# Altium project 16Z.PrjPcb
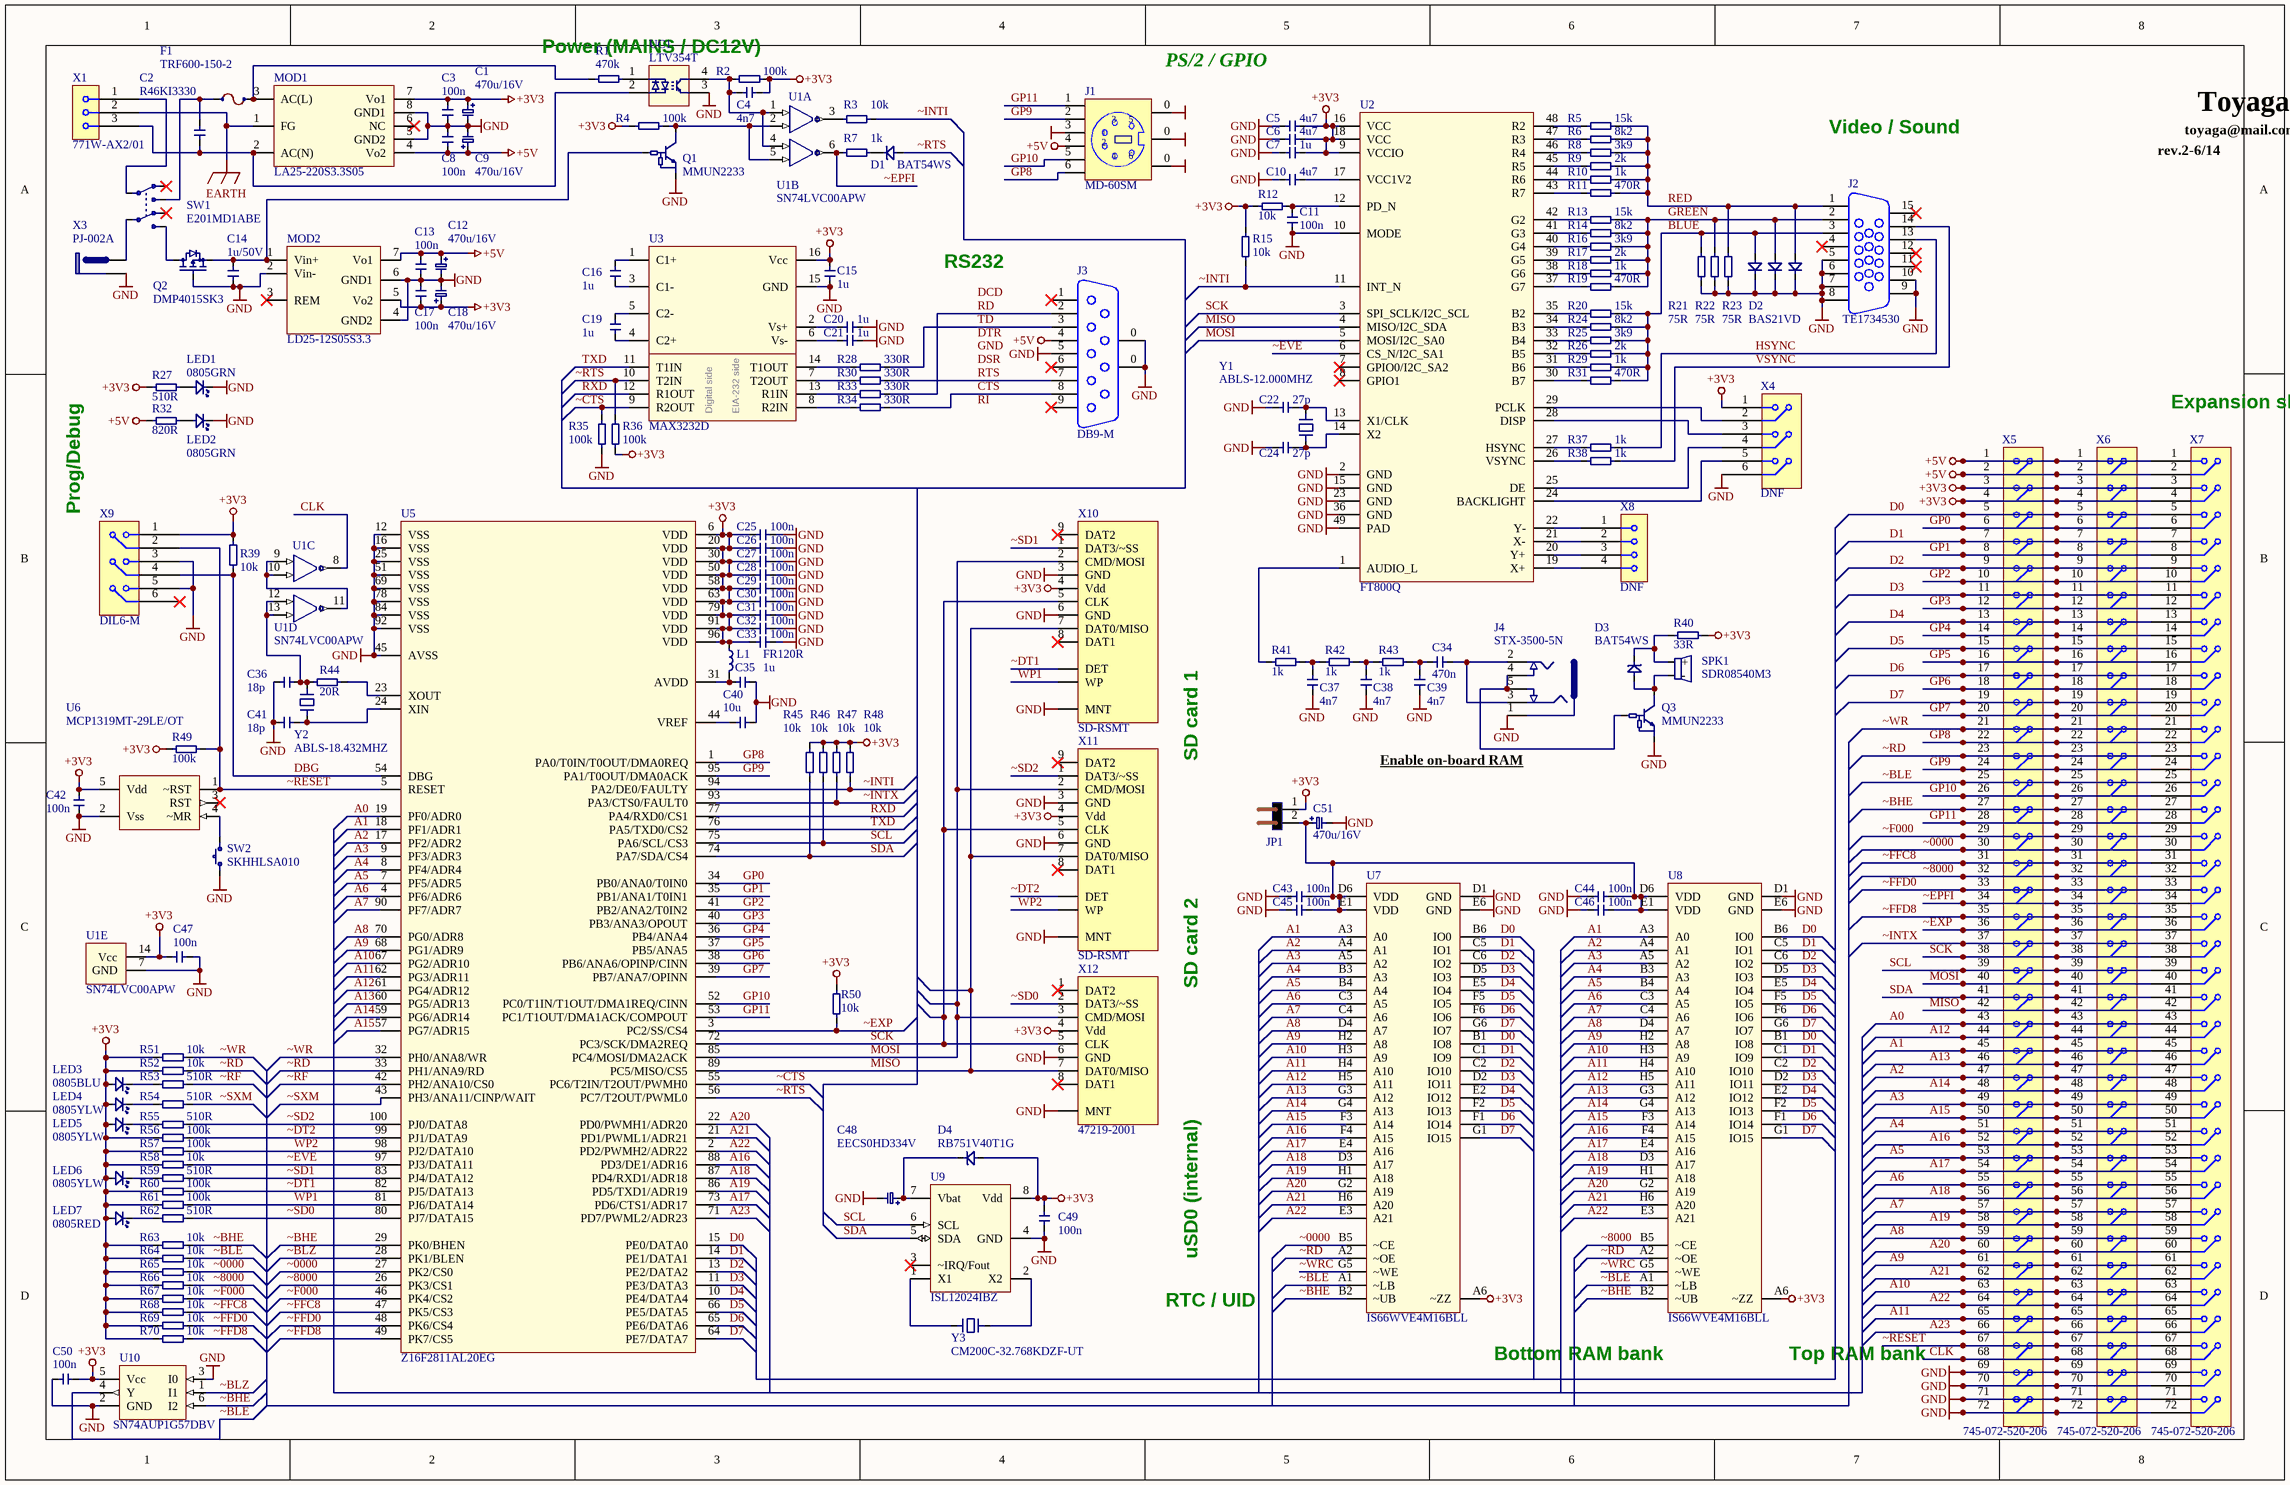
[diagram p0: Schematic.SchDoc]
2 sheets, 181 parts. Net scope: global (net labels, ports and power ports of the same name join across sheets).
Board file: PCB.PcbDoc
Sheets:
  Schematic.SchDoc
  Additions.SchDoc

## Sheet Schematic.SchDoc
size Tabloid

### Parts
C1  470u/16V  [8.5 x 8.5]
C2  R46KI3330  [X2_15MM]
C3  100n  [_0805]
C4  4n7  [_0805]
C5  4u7  [_0805]
C6  4u7  [_0805]
C7  1u  [_0805]
C8  100n  [_0805]
C9  470u/16V  [8.5 x 8.5]
C10  4u7  [_0805]
C11  100n  [_0805]
C12  470u/16V  [8.5 x 8.5]
C13  100n  [_0805]
C14  1u/50V  [_1206]
C15  1u  [_0805]
C16  1u  [_0805]
C17  100n  [_0805]
C18  470u/16V  [8.5 x 8.5]
C19  1u  [_0805]
C20  1u  [_0805]
C21  1u  [_0805]
C22  27p  [_0805]
C24  27p  [_0805]
C25  100n  [_0805]
C26  100n  [_0805]
C27  100n  [_0805]
C28  100n  [_0805]
C29  100n  [_0805]
C30  100n  [_0805]
C31  100n  [_0805]
C32  100n  [_0805]
C33  100n  [_0805]
C34  470n  [_0805]
C35  1u  [_0805]
C36  18p  [_0805]
C37  4n7  [_0805]
C38  4n7  [_0805]
C39  4n7  [_0805]
C40  10u  [_0805]
C41  18p  [_0805]
C42  100n  [_0805]
C43  100n  [_0805]
C44  100n  [_0805]
C45  100n  [_0805]
C46  100n  [_0805]
C47  100n  [_0805]
C48  EECS0HD334V  [D10.5 x L5.5]
C49  100n  [_0805]
C50  100n  [_0805]
C51  470u/16V  [8.5 x 8.5]
D1  BAT54WS  [SOD-323 (MicroMELF)]
D2  BAS21VD  [SOT23-6]
D3  BAT54WS  [SOD-323 (MicroMELF)]
D4  RB751V40T1G  [SOD-323 (MicroMELF)]
F1  TRF600-150-2  [Fuse 5.1mm pitch]
J1  MD-60SM  [MD-60SM]
J2  TE1734530  [DB15F R/A VGA]
J3  DB9-M  [DB9M R/A]
J4  STX-3500-5N  [STX-3500]
JP1  SIL2-M  [2011-1X02S]  (value not drawn)
L1  FR120R  [_0805]
LED1  0805GRN  [_0805+]
LED2  0805GRN  [_0805+]
LED3  0805BLU  [_0805+]
LED4  0805YLW  [_0805+]
LED5  0805YLW  [_0805+]
LED6  0805YLW  [_0805+]
LED7  0805RED  [_0805+]
MOD1  LA25-220S3.3S05  [ECCO AC-DC (70x48)]
MOD2  LD25-12S05S3.3  [DC-DC (50.8x50.8)]
Q1  MMUN2233  [SOT23-3]
Q2  DMP4015SK3  [TO252-3N]
Q3  MMUN2233  [SOT23-3]
R1  470k  [_0805]
R2  100k  [_0805]
R3  10k  [_0805]
R4  100k  [_0805]
R5  15k  [_0805]
R6  8k2  [_0805]
R7  1k  [_0805]
R8  3k9  [_0805]
R9  2k  [_0805]
R10  1k  [_0805]
R11  470R  [_0805]
R12  10k  [_0805]
R13  15k  [_0805]
R14  8k2  [_0805]
R15  10k  [_0805]
R16  3k9  [_0805]
R17  2k  [_0805]
R18  1k  [_0805]
R19  470R  [_0805]
R20  15k  [_0805]
R21  75R  [_0805]
R22  75R  [_0805]
R23  75R  [_0805]
R24  8k2  [_0805]
R25  3k9  [_0805]
R26  2k  [_0805]
R27  510R  [_0805]
R28  330R  [_0805]
R29  1k  [_0805]
R30  330R  [_0805]
R31  470R  [_0805]
R32  820R  [_0805]
R33  330R  [_0805]
R34  330R  [_0805]
R35  100k  [_0805]
R36  100k  [_0805]
R37  1k  [_0805]
R38  1k  [_0805]
R39  10k  [_0805]
R40  33R  [_0805]
R41  1k  [_0805]
R42  1k  [_0805]
R43  1k  [_0805]
R44  20R  [_0805]
R45  10k  [_0805]
R46  10k  [_0805]
R47  10k  [_0805]
R48  10k  [_0805]
R49  100k  [_0805]
R50  10k  [_0805]
R51  10k  [_0805]
R52  10k  [_0805]
R53  510R  [_0805]
R54  510R  [_0805]
R55  510R  [_0805]
R56  100k  [_0805]
R57  100k  [_0805]
R58  10k  [_0805]
R59  510R  [_0805]
R60  100k  [_0805]
R61  100k  [_0805]
R62  510R  [_0805]
R63  10k  [_0805]
R64  10k  [_0805]
R65  10k  [_0805]
R66  10k  [_0805]
R67  10k  [_0805]
R68  10k  [_0805]
R69  10k  [_0805]
R70  10k  [_0805]
SPK1  SDR08540M3  [SDR08540M3-01]
SW1  E201MD1ABE  [E201MD1ABE]
SW2  SKHHLSA010  [SKHH-HORIZONTAL]
U1  SN74LVC00APW  [TSOP65P640-14N]  (value not drawn)  (parts A,B,C,D,E of 5)
U2  FT800Q  [QFN50P700X700-48W2N]
U3  MAX3232D  [SOIC16]
U5  Z16F2811AL20EG  [LQFP100]
U6  MCP1319MT-29LE/OT  [SOT23-5]
U7  IS66WVE4M16BLL  [BGA75P6X8-48]
U8  IS66WVE4M16BLL  [BGA75P6X8-48]
U9  ISL12024IBZ  [SOIC8]
U10  SN74AUP1G57DBV  [SOT23-6]
UC1  LTV354T  [SO4]
X1  771W-AX2/01  [771W-AX2/01]
X3  PJ-002A  [KLD-0202]
X4  DNF  [2011-2X03S]
X5  745-072-520-206  [745-072-520-206]
X6  745-072-520-206  [745-072-520-206]
X7  745-072-520-206  [745-072-520-206]
X8  DNF  [2011-1X04S]
X9  DIL6-M  [2011-2X03S]
X10  SD-RSMT  [SD-RSMT]
X11  SD-RSMT  [SD-RSMT]
X12  47219-2001  [MOLEX_47219-2001]
Y1  ABLS-12.000MHZ  [HC49/SMT]
Y2  ABLS-18.432MHZ  [HC49/SMT]
Y3  CM200C-32.768KDZF-UT  [Crystal 79X37 (4)]

### Nets
+3V3: C1.1 C3.2 C4.2 C5.1 C6.1 C7.1 C15.1 C17.2 C18.1 C25.2 C26.2 C27.2 C28.2 C29.2 C30.2 C31.2 C32.2 C33.2 C42.1 C47.1 C49.1 C50.2 D4.2 JP1.1 L1.2 LED3.2 LED4.2 LED5.2 LED6.2 LED7.2 MOD1.7(Vo1) MOD2.5(Vo2) R2.2 R4.1 R12.1 R15.2 R27.2 R36.1 R39.1 R40.2 R45.2 R46.2 R47.2 R48.2 R49.2 R50.2 R51.2 R52.2 R56.2 R57.2 R58.2 R60.2 R61.2 R63.2 R64.2 R65.2 R66.2 R67.2 R68.2 R69.2 R70.2 U1.14(Vcc) U2.9(VCCIO) U2.16(VCC) U2.18(VCC) U3.16(Vcc) U5.6(VDD) U5.20(VDD) U5.30(VDD) U5.50(VDD) U5.58(VDD) U5.63(VDD) U5.79(VDD) U5.91(VDD) U5.96(VDD) U6.5(Vdd) U7.A6(~ZZ) U8.A6(~ZZ) U9.8(Vdd) U10.5(Vcc) X4.1 X5.3 X5.4 X6.3 X6.4 X7.3 X7.4 X9.1 X10.4(Vdd) X11.4(Vdd) X12.4(Vdd)
+5V: C8.1 C9.1 C12.1 C13.1 J1.4 J3.4 MOD1.4(Vo2) MOD2.7(Vo1) R32.2 X5.1 X5.2 X6.1 X6.2 X7.1 X7.2
EARTH: MOD1.1(FG) X1.2
GND: C1.2 C3.1 C5.2 C6.2 C7.2 C8.2 C9.2 C10.2 C11.2 C12.2 C13.2 C14.2 C15.2 C17.1 C18.2 C20.1 C21.1 C22.2 C24.2 C25.1 C26.1 C27.1 C28.1 C29.1 C30.1 C31.1 C32.1 C33.1 C35.1 C36.2 C37.1 C38.1 C39.1 C40.1 C41.2 C42.2 C43.2 C44.2 C45.2 C46.2 C47.2 C48.2 C49.2 C50.1 C51.2 D2.1 D2.2 D2.3 J1.0 J1.3 J2.5 J2.6 J2.7 J2.8 J2.9 J2.10 J3.0 J3.5 J4.1 LED1.1 LED2.1 MOD1.5(GND2) MOD1.8(GND1) MOD2.2(Vin-) MOD2.4(GND2) MOD2.6(GND1) Q1.2(E) Q2.1(G) Q3.2(E) R21.1 R22.1 R23.1 R35.1 SW2.1 U1.7(GND) U2.2(GND) U2.10(MODE) U2.15(GND) U2.23(GND) U2.36(GND) U2.49(PAD) U3.15(GND) U5.12(VSS) U5.16(VSS) U5.25(VSS) U5.45(AVSS) U5.51(VSS) U5.69(VSS) U5.78(VSS) U5.84(VSS) U5.92(VSS) U6.2(Vss) U7.D1(GND) U7.E6(GND) U8.D1(GND) U8.E6(GND) U9.4(GND) U10.2(GND) U10.3(I0) UC1.3 X3.2 X4.6 X5.69 X5.70 X5.71 X5.72 X6.69 X6.70 X6.71 X6.72 X7.69 X7.70 X7.71 X7.72 X9.3 X9.5 X10.0(MNT) X10.3(GND) X10.6(GND) X11.0(MNT) X11.3(GND) X11.6(GND) X12.0(MNT) X12.6(GND)
A0: U5.19(PF0/ADR0) X5.43 X6.43 X7.43
A1: U5.18(PF1/ADR1) U7.A3(A0) U8.A3(A0) X5.45 X6.45 X7.45
A2: U5.17(PF2/ADR2) U7.A4(A1) U8.A4(A1) X5.47 X6.47 X7.47
A3: U5.9(PF3/ADR3) U7.A5(A2) U8.A5(A2) X5.49 X6.49 X7.49
A4: U5.8(PF4/ADR4) U7.B3(A3) U8.B3(A3) X5.51 X6.51 X7.51
A5: U5.7(PF5/ADR5) U7.B4(A4) U8.B4(A4) X5.53 X6.53 X7.53
A6: U5.4(PF6/ADR6) U7.C3(A5) U8.C3(A5) X5.55 X6.55 X7.55
A7: U5.90(PF7/ADR7) U7.C4(A6) U8.C4(A6) X5.57 X6.57 X7.57
A8: U5.70(PG0/ADR8) U7.D4(A7) U8.D4(A7) X5.59 X6.59 X7.59
A9: U5.68(PG1/ADR9) U7.H2(A8) U8.H2(A8) X5.61 X6.61 X7.61
A10: U5.67(PG2/ADR10) U7.H3(A9) U8.H3(A9) X5.63 X6.63 X7.63
A11: U5.62(PG3/ADR11) U7.H4(A10) U8.H4(A10) X5.65 X6.65 X7.65
A12: U5.61(PG4/ADR12) U7.H5(A11) U8.H5(A11) X5.44 X6.44 X7.44
A13: U5.60(PG5/ADR13) U7.G3(A12) U8.G3(A12) X5.46 X6.46 X7.46
A14: U5.59(PG6/ADR14) U7.G4(A13) U8.G4(A13) X5.48 X6.48 X7.48
A15: U5.57(PG7/ADR15) U7.F3(A14) U8.F3(A14) X5.50 X6.50 X7.50
A16: U5.88(PD3/DE1/ADR16) U7.F4(A15) U8.F4(A15) X5.52 X6.52 X7.52
A17: U5.73(PD6/CTS1/ADR17) U7.E4(A16) U8.E4(A16) X5.54 X6.54 X7.54
A18: U5.87(PD4/RXD1/ADR18) U7.D3(A17) U8.D3(A17) X5.56 X6.56 X7.56
A19: U5.86(PD5/TXD1/ADR19) U7.H1(A18) U8.H1(A18) X5.58 X6.58 X7.58
A20: U5.22(PD0/PWMH1/ADR20) U7.G2(A19) U8.G2(A19) X5.60 X6.60 X7.60
A21: U5.21(PD1/PWML1/ADR21) U7.H6(A20) U8.H6(A20) X5.62 X6.62 X7.62
A22: U5.2(PD2/PWMH2/ADR22) U7.E3(A21) U8.E3(A21) X5.64 X6.64 X7.64
A23: U5.71(PD7/PWML2/ADR23) X5.66 X6.66 X7.66
BLUE: D2.6 J2.3 R20.2 R21.2 R24.2 R25.2 R26.2 R29.2 R31.2
CLK: U1.8 X5.68 X6.68 X7.68
CTS: J3.8 R34.2
D0: U5.15(PE0/DATA0) U7.B1(IO8) U7.B6(IO0) U8.B1(IO8) U8.B6(IO0) X5.5 X6.5 X7.5
D1: U5.14(PE1/DATA1) U7.C1(IO9) U7.C5(IO1) U8.C1(IO9) U8.C5(IO1) X5.7 X6.7 X7.7
D2: U5.13(PE2/DATA2) U7.C2(IO10) U7.C6(IO2) U8.C2(IO10) U8.C6(IO2) X5.9 X6.9 X7.9
D3: U5.11(PE3/DATA3) U7.D2(IO11) U7.D5(IO3) U8.D2(IO11) U8.D5(IO3) X5.11 X6.11 X7.11
D4: U5.10(PE4/DATA4) U7.E2(IO12) U7.E5(IO4) U8.E2(IO12) U8.E5(IO4) X5.13 X6.13 X7.13
D5: U5.66(PE5/DATA5) U7.F2(IO13) U7.F5(IO5) U8.F2(IO13) U8.F5(IO5) X5.15 X6.15 X7.15
D6: U5.65(PE6/DATA6) U7.F1(IO14) U7.F6(IO6) U8.F1(IO14) U8.F6(IO6) X5.17 X6.17 X7.17
D7: U5.64(PE7/DATA7) U7.G1(IO15) U7.G6(IO7) U8.G1(IO15) U8.G6(IO7) X5.19 X6.19 X7.19
DBG: R39.2 U5.54(DBG) X9.4
GP0: U5.34(PB0/ANA0/T0IN0) X5.6 X6.6 X7.6
GP1: U5.35(PB1/ANA1/T0IN1) X5.8 X6.8 X7.8
GP2: U5.41(PB2/ANA2/T0IN2) X5.10 X6.10 X7.10
GP3: U5.40(PB3/ANA3/OPOUT) X5.12 X6.12 X7.12
GP4: U5.36(PB4/ANA4) X5.14 X6.14 X7.14
GP5: U5.37(PB5/ANA5) X5.16 X6.16 X7.16
GP6: U5.38(PB6/ANA6/OPINP/CINN) X5.18 X6.18 X7.18
GP7: U5.39(PB7/ANA7/OPINN) X5.20 X6.20 X7.20
GP8: J1.6 U5.1(PA0/T0IN/T0OUT/DMA0REQ) X5.22 X6.22 X7.22
GP9: J1.2 U5.95(PA1/T0OUT/DMA0ACK) X5.24 X6.24 X7.24
GP10: J1.5 U5.52(PC0/T1IN/T1OUT/DMA1REQ/CINN) X5.26 X6.26 X7.26
GP11: J1.1 U5.53(PC1/T1OUT/DMA1ACK/COMPOUT) X5.28 X6.28 X7.28
GREEN: D2.5 J2.2 R13.2 R14.2 R16.2 R17.2 R18.2 R19.2 R22.2
HSYNC: J2.13 R37.2
MISO: U2.4(MISO/I2C_SDA) U5.89(PC5/MISO/CS5) X5.42 X6.42 X7.42 X10.7(DAT0/MISO) X11.7(DAT0/MISO) X12.7(DAT0/MISO)
MOSI: U2.5(MOSI/I2C_SA0) U5.85(PC4/MOSI/DMA2ACK) X5.40 X6.40 X7.40 X10.2(CMD/MOSI) X11.2(CMD/MOSI) X12.3(CMD/MOSI)
RD: J3.2 R33.2
RED: D2.4 J2.1 R5.2 R6.2 R8.2 R9.2 R10.2 R11.2 R23.2
RTS: J3.7 R30.2
RXD: U3.12(R1OUT) U5.77(PA4/RXD0/CS1)
SCK: U2.3(SPI_SCLK/I2C_SCL) U5.72(PC3/SCK/DMA2REQ) X5.38 X6.38 X7.38 X10.5(CLK) X11.5(CLK) X12.5(CLK)
SCL: R46.1 U5.75(PA6/SCL/CS3) U9.6(SCL) X5.39 X6.39 X7.39
SDA: R45.1 U5.74(PA7/SDA/CS4) U9.5(SDA) X5.41 X6.41 X7.41
TD: J3.3 R28.2
TXD: U3.11(T1IN) U5.76(PA5/TXD0/CS2)
VSYNC: J2.14 R38.2
WP1: R61.1 U5.81(PJ6/DATA14) X10.WP
WP2: R57.1 U5.98(PJ2/DATA10) X11.WP
~0000: R65.1 U5.27(PK2/CS0) U7.B5(~CE) X5.30 X6.30 X7.30
~8000: R66.1 U5.26(PK3/CS1) U8.B5(~CE) X5.32 X6.32 X7.32
~BHE: R63.1 U5.29(PK0/BHEN) U7.B2(~UB) U8.B2(~UB) U10.6(I2) X5.27 X6.27 X7.27
~BLE: R64.1 U7.A1(~LB) U8.A1(~LB) U10.4(Y) X5.25 X6.25 X7.25
~BLZ: U5.28(PK1/BLEN) U10.1(I1)
~CTS: R35.2 U3.9(R2OUT) U5.55(PC6/T2IN/T2OUT/PWMH0)
~DT1: R60.1 U5.82(PJ5/DATA13) X10.DET
~DT2: R56.1 U5.99(PJ1/DATA9) X11.DET
~EPFI: R7.1 U1.6 X5.34 X6.34 X7.34
~EVE: R58.1 U2.6(CS_N/I2C_SA1) U5.97(PJ3/DATA11)
~EXP: R50.1 U5.3(PC2/SS/CS4) X5.36 X6.36 X7.36
~F000: R67.1 U5.46(PK4/CS2) X5.29 X6.29 X7.29
~FFC8: R68.1 U5.47(PK5/CS3) X5.31 X6.31 X7.31
~FFD0: R69.1 U5.48(PK6/CS4) X5.33 X6.33 X7.33
~FFD8: R70.1 U5.49(PK7/CS5) X5.35 X6.35 X7.35
~INTI: R3.2 R15.1 R48.1 U2.11(INT_N) U5.94(PA2/DE0/FAULTY)
~INTX: R47.1 U5.93(PA3/CTS0/FAULT0) X5.37 X6.37 X7.37
~RD: R52.1 U5.33(PH1/ANA9/RD) U7.A2(~OE) U8.A2(~OE) X5.23 X6.23 X7.23
~RESET: R49.1 U5.5(RESET) U6.1(~RST) X5.67 X6.67 X7.67 X9.2
~RF: R53.1 U5.42(PH2/ANA10/CS0)
~RTS: D1.2 R36.2 U3.10(T2IN) U5.56(PC7/T2OUT/PWML0)
~SD0: R62.1 U5.80(PJ7/DATA15) X12.2(DAT3/~SS)
~SD1: R59.1 U5.83(PJ4/DATA12) X10.1(DAT3/~SS)
~SD2: R55.1 U5.100(PJ0/DATA8) X11.1(DAT3/~SS)
~SXM: R54.1 U5.43(PH3/ANA11/CINP/WAIT)
~WR: R51.1 U5.32(PH0/ANA8/WR) X5.21 X6.21 X7.21
~WRC: U7.G5(~WE) U8.G5(~WE)
NetC2_1: C2.1 F1.1 SW1.1
NetC2_2: C2.2 MOD1.2(AC(N)) UC1.2 X1.3
NetC4_1: C4.1 R2.1 U1.1 U1.4 UC1.4
NetC10_1: C10.1 U2.17(VCC1V2)
NetC11_1: C11.1 R12.2 U2.12(PD_N)
NetC14_1: C14.1 MOD2.1(Vin+) Q1.1(B) Q2.2(S)
NetC16_1: C16.1 U3.1(C1+)
NetC16_2: C16.2 U3.3(C1-)
NetC19_1: C19.1 U3.5(C2-)
NetC19_2: C19.2 U3.4(C2+)
NetC20_2: C20.2 U3.2(Vs+)
NetC21_2: C21.2 U3.6(Vs-)
NetC22_1: C22.1 U2.13(X1/CLK) Y1.2
NetC24_1: C24.1 U2.14(X2) Y1.1
NetC34_1: C34.1 C39.2 R43.2
NetC34_2: C34.2 J4.2 J4.3
NetC35_2: C35.2 L1.1 U5.31(AVDD)
NetC36_1: C36.1 R44.2 U1.12 U1.13 Y2.2
NetC37_2: C37.2 R41.2 R42.1
NetC38_2: C38.2 R42.2 R43.1
NetC40_2: C40.2 U5.44(VREF)
NetC41_1: C41.1 U5.24(XIN) Y2.1
NetC43_1: C43.1 C44.1 C45.1 C46.1 C51.1 JP1.2 U7.D6(VDD) U7.E1(VDD) U8.D6(VDD) U8.E1(VDD)
NetC48_1: C48.1 D4.1 U9.7(Vbat)
NetD1_1: D1.1 R7.2
NetD3_1: D3.1 R40.1 SPK1.1(+)
NetD3_2: D3.2 Q3.3(C) SPK1.2(-)
NetF1_2: F1.2 MOD1.3(AC(L)) R1.1
NetJ4_4: J4.4 J4.5 Q3.1(B)
NetLED1_2: LED1.2 R27.1
NetLED2_2: LED2.2 R32.1
NetLED3_1: LED3.1 R53.2
NetLED4_1: LED4.1 R54.2
NetLED5_1: LED5.1 R55.2
NetLED6_1: LED6.1 R59.2
NetLED7_1: LED7.1 R62.2
NetQ1_3: Q1.3(C) R4.2 U1.2 U1.5
NetQ2_3: Q2.3(D) SW1.4
NetR1_2: R1.2 UC1.1
NetR3_1: R3.1 U1.3
NetR5_1: R5.1 U2.48(R2)
NetR6_1: R6.1 U2.47(R3)
NetR8_1: R8.1 U2.46(R4)
NetR9_1: R9.1 U2.45(R5)
NetR10_1: R10.1 U2.44(R6)
NetR11_1: R11.1 U2.43(R7)
NetR13_1: R13.1 U2.42(G2)
NetR14_1: R14.1 U2.41(G3)
NetR16_1: R16.1 U2.40(G4)
NetR17_1: R17.1 U2.39(G5)
NetR18_1: R18.1 U2.38(G6)
NetR19_1: R19.1 U2.37(G7)
NetR20_1: R20.1 U2.35(B2)
NetR24_1: R24.1 U2.34(B3)
NetR25_1: R25.1 U2.33(B4)
NetR26_1: R26.1 U2.32(B5)
NetR28_1: R28.1 U3.14(T1OUT)
NetR29_1: R29.1 U2.31(B6)
NetR30_1: R30.1 U3.7(T2OUT)
NetR31_1: R31.1 U2.30(B7)
NetR33_1: R33.1 U3.13(R1IN)
NetR34_1: R34.1 U3.8(R2IN)
NetR37_1: R37.1 U2.27(HSYNC)
NetR38_1: R38.1 U2.26(VSYNC)
NetR41_1: R41.1 U2.1(AUDIO_L)
NetR44_1: R44.1 U5.23(XOUT)
NetSW1_2: SW1.2 X1.1
NetSW1_5: SW1.5 X3.1
NetSW2_2: SW2.2 U6.4(~MR)
NetU1_9: U1.9 U1.10 U1.11
NetU2_19: U2.19(X+) X8.4
NetU2_20: U2.20(Y+) X8.3
NetU2_21: U2.21(X-) X8.2
NetU2_22: U2.22(Y-) X8.1
NetU2_24: U2.24(BACKLIGHT) X4.5
NetU2_25: U2.25(DE) X4.4
NetU2_28: U2.28(DISP) X4.3
NetU2_29: U2.29(PCLK) X4.2
NetU9_1: U9.1(X1) Y3.2
NetU9_2: U9.2(X2) Y3.1

Not connected (* = marked no-connect by the designer): J2 4* 11* 12* 15*; J3 1* 6* 9*; MOD1 6(NC)*; MOD2 3(REM)*; SW1 3* 6*; U2 7(GPIO0/I2C_SA2)* 8(GPIO1)*; U6 3(RST)*; U9 3(~IRQ/Fout)*; X9 6*; X10 8(DAT1)* 9(DAT2)*; X11 8(DAT1)* 9(DAT2)*; X12 1(DAT2)* 8(DAT1)*

### Notes on the sheet
- Power (MAINS / DC12V)
- (near J1) PS/2 / GPIO
- Video / Sound
- rev.2-6/14
- toyaga@mail.com
- Toyaga 16z
- RS232
- Expansion slots
- Prog/Debug
- SD card 1
- Enable on-board RAM
- SD card 2
- uSD0 (internal)
- RTC / UID
- (near U7) Bottom RAM bank
- (near U8) Top RAM bank
- Labels drawn without touching a wire or pin: DCD, DSR, DTR, GND, RI
- (in symbol MAX232) Digital side; EIA-232 side

### Library data of the parts
C1 C9 C12 C18 C48 C51 = Capacitor+: Polar capacitor
C2-C8 C10 C11 C13-C17 C19-C22 C24-C47 C49 C50 = Capacitor
D1 D3 D4 = Diode Schottky: Schottky diode
D2 = Diode Triple: Diode (triple)
F1 = Fuse Resettable
J1 = MD-60SM: 6-pin mini-DIN connector (female) PS/2
J2 = DB15 (3 rows): DB15 (3 rows) connector R/A
J3 = DB9: DB9 connector
J4 = Phono Jack Stereo (switchless): Phono Jack (stereo)
JP1 = Jumper 2: 2.54mm square pin header/jumper
L1 = Inductor
LED1-LED7 = LED: Light Emitting Diode
MOD1 = ECCO AC-DC dual: Miniature AC/DC module; Manufacturer: ECCO; Options: 3V3, 5V, 6V, 9V, 12V, 15V, 18V, 24V, 48V; URL: www.eccoelec.com
MOD2 = ECCO DC-DC dual: DC-DC converter isolated output with common ground and control; URL: www.eccoelec.com
Q1 Q3 = NPN BIASED: NPN biased bipolar transistor
Q2 = P-FET: P-channel FET transistor
R1-R70 = Resistor
SPK1 = Speaker: Speaker/Buzzer
SW1 = Switch DPDT: Switch
SW2 = Switch MNO SPST: Switch, Momentary, Normal Open
U1 = 74xxx00: Quad NAND
U2 = FT800Q: Embedded Video Engine; Manufacturer: FTDI; URL: http://www.ftdichip.com/EVE.htm
U3 = MAX232: Dual EIA-232 drivers; Manufacturer: TI (and others); Package options: D (SOIC); N (DIP); DW (SOICW)
U5 = Z16F (QFP100): 16-bit microcontroller/microprocessor; Manufacturer: Zilog
U6 = MCP1319: Voltage Supervisor; Manufacturer: Microchip
U7 U8 = IS66WVE4M16 BGA: 4M x 16 high speed asynchronous pseudostatic RAM; Suffix: BLL (BGA, high-speed); BLS (BGA, low-power)
U9 = ISL12024: Real-Time Clock/Calendar with Embedded  Unique ID; Manufacturer: Intersil; Pin-compatible: ISL12026
U10 = SN74AUP1G57: Universal logic element; Manufacturer: Texas Instruments; NOTE:: Similar parts available: 1G58, 1G97, 1G98...
UC1 = OPTO AC: Optocoupler AC
X1 = Connector 1x3: Single row, 3-way connector
X3 = Power Jack 2.5: Power Jack 2.1mm or 2.5mm
X4 X9 = Connector 2x3: Dual row, 6-way connector
X5-X7 = Connector 2x36: Dual row, 72-way connector
X8 = Connector 1x4: Single row, 4-way connector
X10 X11 = SD (w/ card detect and WP): SD card connector
X12 = microSD: microSD card connector
Y1-Y3 = Crystal: Crystal Resonator

## Sheet Additions.SchDoc
size A4
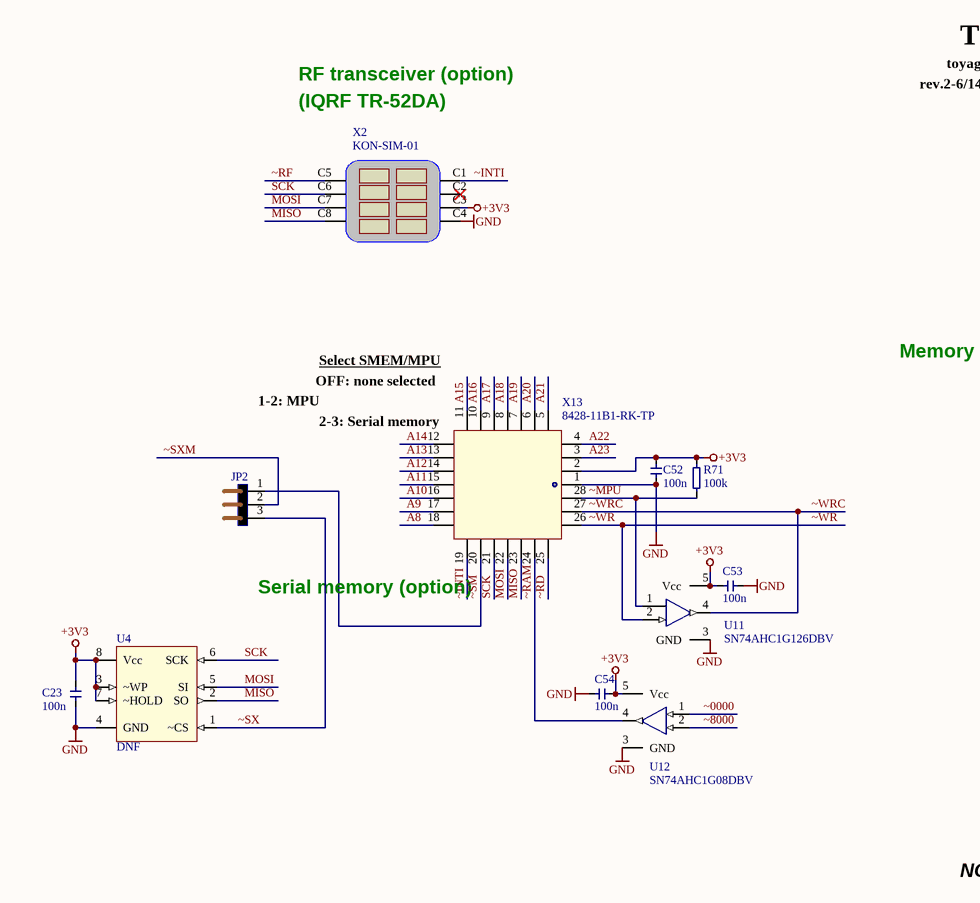
[diagram p1: Additions.SchDoc]

### Parts
C23  100n  [_0805]
C52  100n  [_0805]
C53  100n  [_0805]
C54  100n  [_0805]
JP2  Jumper 3  [2011-1X03S]  (value not drawn)
R71  100k  [_0805]
U4  DNF  [SOIC127P760-8N]
U11  SN74AHC1G126DBV  [SOT23-5]
U12  SN74AHC1G08DBV  [SOT23-5]
X2  KON-SIM-01  [KON-SIM-01]
X13  8428-11B1-RK-TP  [PLCC28-T/H socket]

### Nets
+3V3: C23.1 C52.1 C53.1 C54.2 R71.2 U4.3(~WP) U4.7(~HOLD) U4.8(Vcc) U11.5(Vcc) U12.5(Vcc) X2.C3 X13.2
GND: C23.2 C52.2 C53.2 C54.1 U4.4(GND) U11.3(GND) U12.3(GND) X2.C4 X13.1
A8: X13.18
A9: X13.17
A10: X13.16
A11: X13.15
A12: X13.14
A13: X13.13
A14: X13.12
A15: X13.11
A16: X13.10
A17: X13.9
A18: X13.8
A19: X13.7
A20: X13.6
A21: X13.5
A22: X13.4
A23: X13.3
MISO: U4.2(SO) X2.C8 X13.23
MOSI: U4.5(SI) X2.C7 X13.22
SCK: U4.6(SCK) X2.C6 X13.21
~0000: U12.1
~8000: U12.2
~INTI: X2.C1 X13.19
~MPU: R71.1 U11.1(OE) X13.28
~RAM: U12.4 X13.24
~RD: X13.25
~RF: X2.C5
~SM: JP2.1 X13.20
~SX: JP2.3 U4.1(~CS)
~SXM: JP2.2
~WR: U11.2(A) X13.26
~WRC: U11.4 X13.27

Not connected (* = marked no-connect by the designer): X2 C2*

### Notes on the sheet
- RF transceiver (option)
- rev.2-6/14
- toyaga@mail.com
- Toyaga 16z
- (IQRF TR-52DA)
- Select SMEM/MPU
- Memory protection unit (option)
- 1-2: MPU
- OFF: none selected
- 2-3: Serial memory
- Serial memory (option)
- NOTE: 'Serial memory' and 'Memory protection unit' options are mutually exclusive

### Library data of the parts
C23 C52-C54 = Capacitor
JP2 = Jumper 3: 2.54mm square pin header/jumper
R71 = Resistor
U4 = SPI Flash 8pin: Standard 8-pin SPI flash memory
U11 = SN74xxx1G126: Buffer gate with non-invertinng Enable input; Manufacturer: Texas Instruments
U12 = SN74xxx1G08: 2-INPUT AND GATE; Manufacturer: Texas Instruments
X2 = SIM/microSIM (8-pin): SIM/microSIM 6-pin connector
X13 = PLCC28 socket: PLCC28 T/H socket

## Nets that join several sheets
+3V3: Schematic (91 pins), Additions (12 pins)
GND: Schematic (124 pins), Additions (9 pins)
A8: Schematic (6 pins), Additions (X13.18)
A9: Schematic (6 pins), Additions (X13.17)
A10: Schematic (6 pins), Additions (X13.16)
A11: Schematic (6 pins), Additions (X13.15)
A12: Schematic (6 pins), Additions (X13.14)
A13: Schematic (6 pins), Additions (X13.13)
A14: Schematic (6 pins), Additions (X13.12)
A15: Schematic (6 pins), Additions (X13.11)
A16: Schematic (6 pins), Additions (X13.10)
A17: Schematic (6 pins), Additions (X13.9)
A18: Schematic (6 pins), Additions (X13.8)
A19: Schematic (6 pins), Additions (X13.7)
A20: Schematic (6 pins), Additions (X13.6)
A21: Schematic (6 pins), Additions (X13.5)
A22: Schematic (6 pins), Additions (X13.4)
A23: Schematic (U5.71 X5.66 X6.66 X7.66), Additions (X13.3)
MISO: Schematic (8 pins), Additions (U4.2 X2.C8 X13.23)
MOSI: Schematic (8 pins), Additions (U4.5 X2.C7 X13.22)
SCK: Schematic (8 pins), Additions (U4.6 X2.C6 X13.21)
~0000: Schematic (6 pins), Additions (U12.1)
~8000: Schematic (6 pins), Additions (U12.2)
~INTI: Schematic (5 pins), Additions (X2.C1 X13.19)
~RD: Schematic (7 pins), Additions (X13.25)
~RF: Schematic (R53.1 U5.42), Additions (X2.C5)
~SXM: Schematic (R54.1 U5.43), Additions (JP2.2)
~WR: Schematic (5 pins), Additions (U11.2 X13.26)
~WRC: Schematic (U7.G5 U8.G5), Additions (U11.4 X13.27)